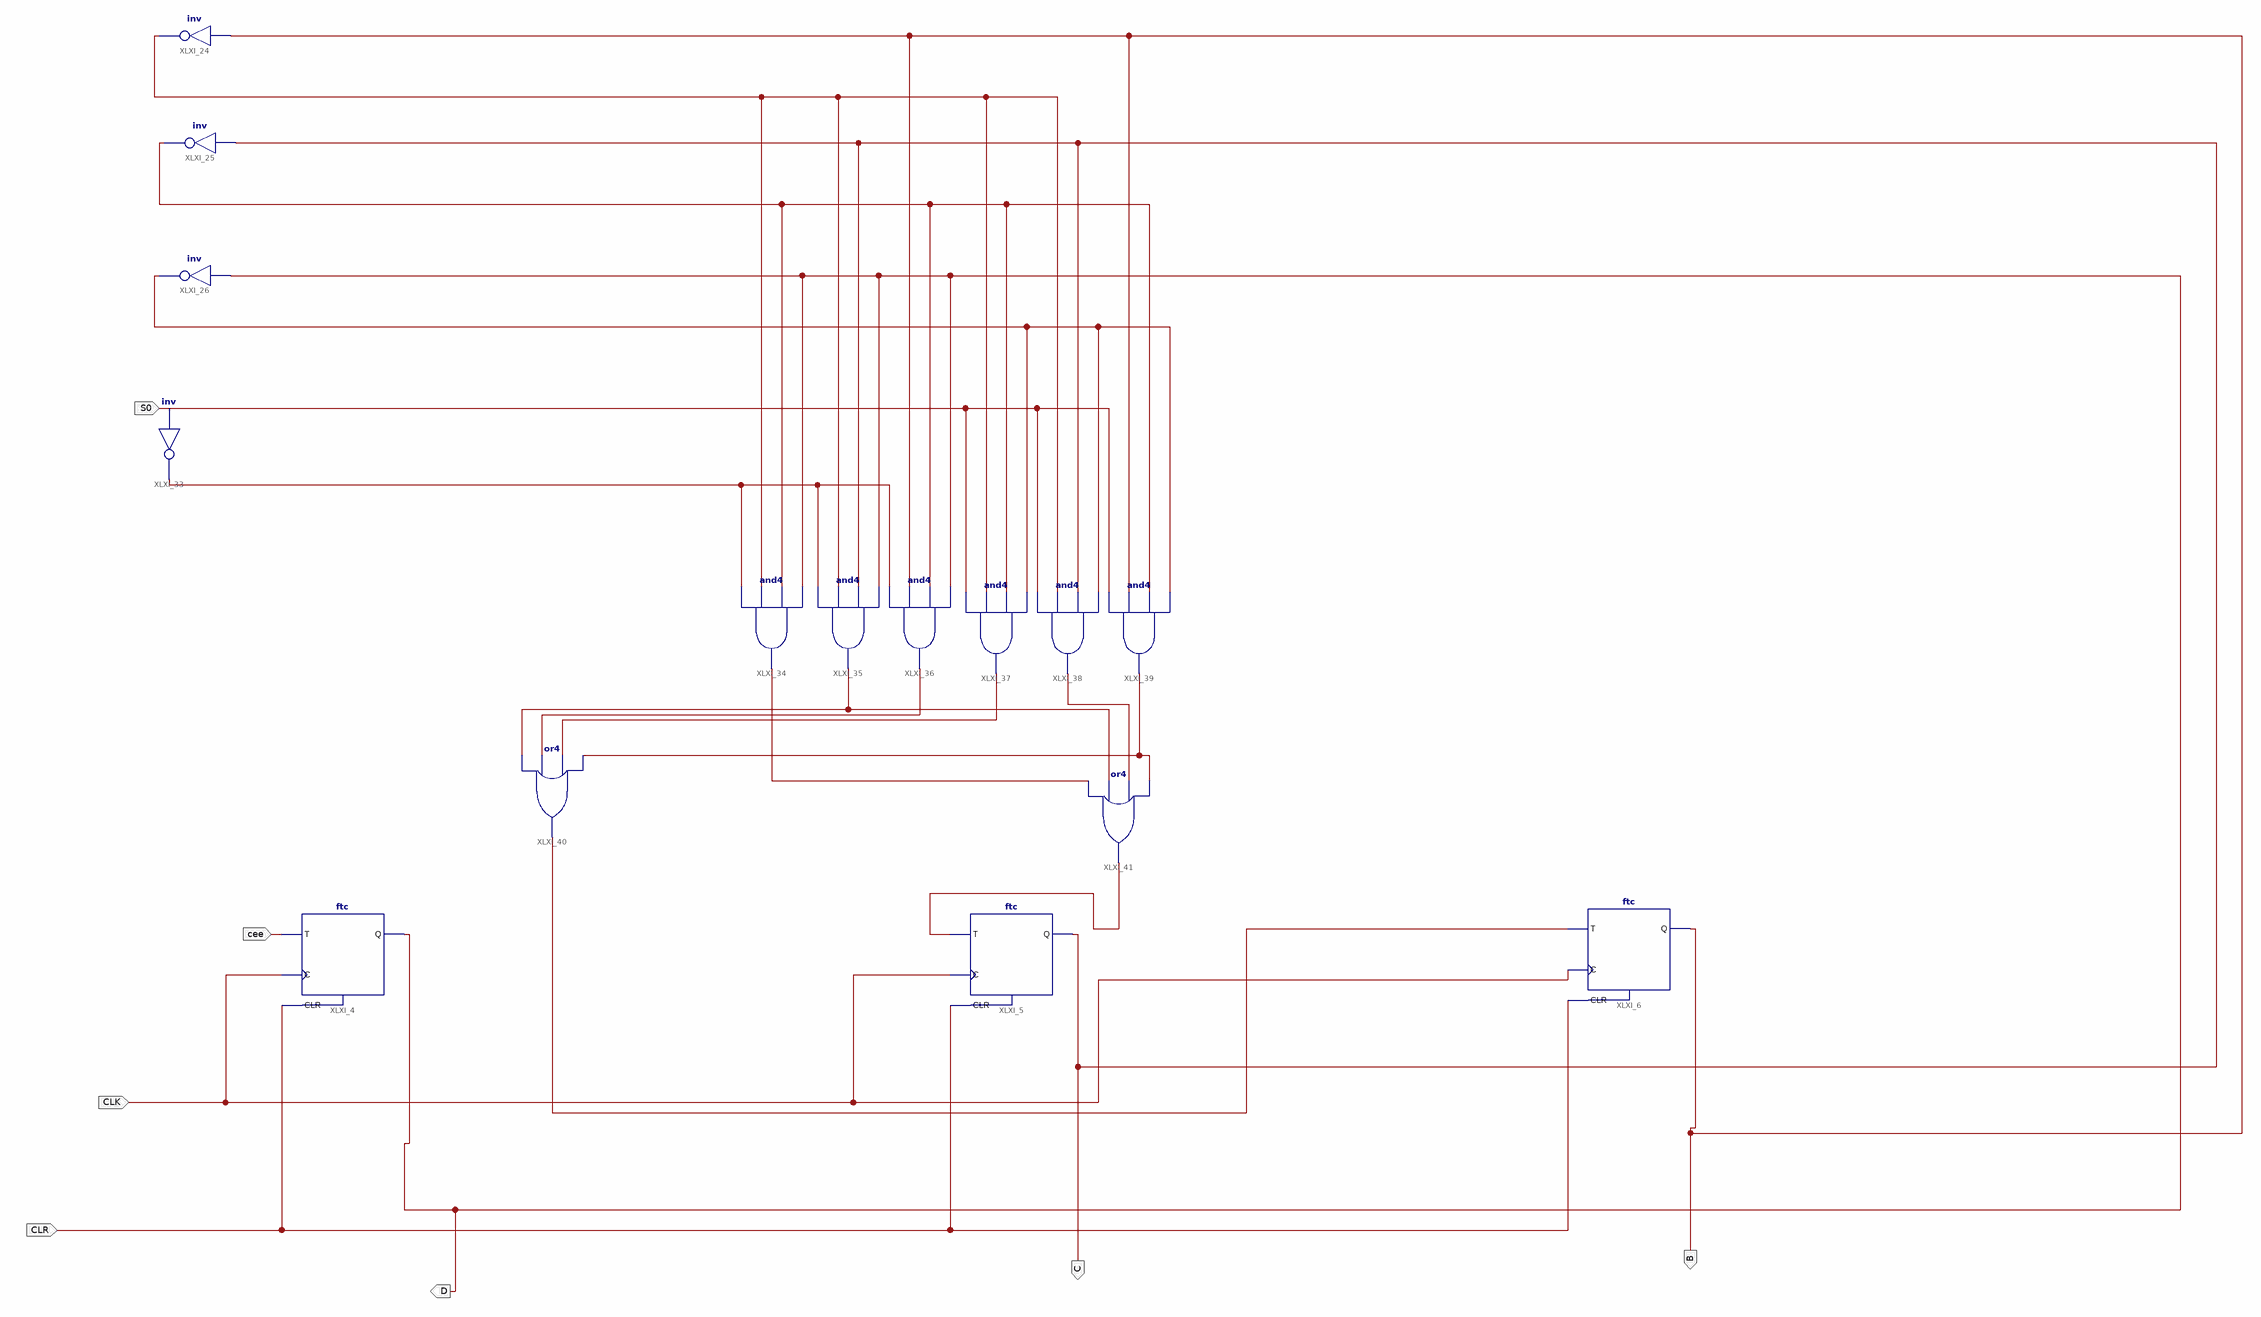
[diagram p0: schematic sheet 1]
// Xilinx ISE schematic ripple00_55new.sch (spartan6) as structural Verilog: 15 symbols, 7 ports
module ripple00_55new (
  input  S0,
  input  cee,
  input  CLR,
  input  CLK,
  output B,
  output D,
  output C
);

  wire XLXN_39, XLXN_41, XLXN_42, XLXN_45, XLXN_59, XLXN_60, XLXN_61, XLXN_62, XLXN_63, XLXN_66, XLXN_76,
       XLXN_77;

  ftc XLXI_4 (.C(CLK), .CLR(CLR), .T(cee), .Q(D));
  ftc XLXI_5 (.C(CLK), .CLR(CLR), .T(XLXN_77), .Q(C));
  ftc XLXI_6 (.C(CLK), .CLR(CLR), .T(XLXN_76), .Q(B));
  not XLXI_24 (XLXN_39, B);
  not XLXI_26 (XLXN_42, D);
  not XLXI_25 (XLXN_41, C);
  not XLXI_33 (XLXN_45, S0);
  and XLXI_34 (XLXN_63, XLXN_45, XLXN_39, XLXN_41, D);
  and XLXI_35 (XLXN_59, XLXN_45, XLXN_39, C, D);
  and XLXI_36 (XLXN_60, XLXN_45, B, XLXN_41, D);
  and XLXI_37 (XLXN_61, S0, XLXN_39, XLXN_41, XLXN_42);
  and XLXI_38 (XLXN_66, S0, XLXN_39, C, XLXN_42);
  and XLXI_39 (XLXN_62, S0, B, XLXN_41, XLXN_42);
  or XLXI_40 (XLXN_76, XLXN_59, XLXN_60, XLXN_61, XLXN_62);
  or XLXI_41 (XLXN_77, XLXN_63, XLXN_59, XLXN_66, XLXN_62);
endmodule
